# EAGLE schematic Datalogger (EAGLE 9.6.2)
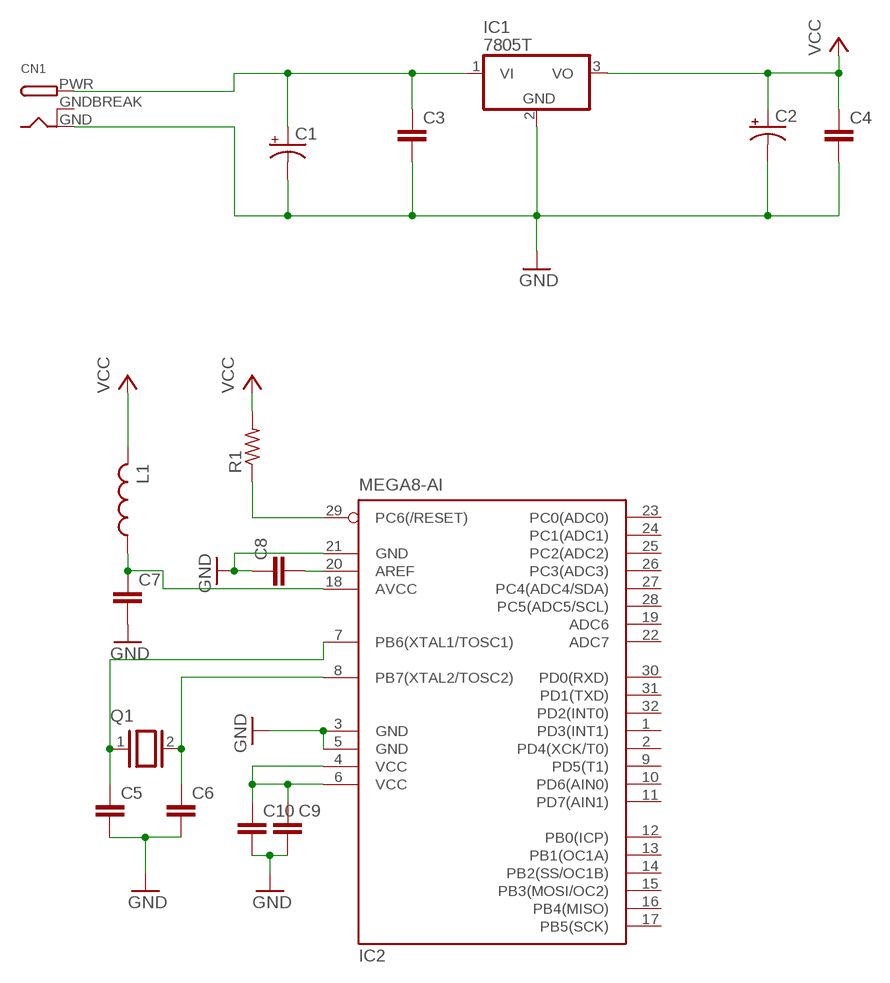
[diagram p0: schematic, sheet 1]

## Parts
C1  CPOL-US140CLH-1010  [140CLH-1010]
C2  CPOL-US140CLH-1010  [140CLH-1010]
C3  C-EUC0603  [C0603]
C4  C-EUC0603  [C0603]
C5  C-EUC0603  [C0603]
C6  C-EUC0603  [C0603]
C7  C-EUC0603  [C0603]
C8  C-EUC0603  [C0603]
C9  C-EUC0603  [C0603]
C10  C-EUC0603  [C0603]
CN1  DCBARRELPTH  [DCJACK_2MM_PTH]
IC1  7805T  [TO220H]
IC2  MEGA8-AI  [TQFP32-08]
L1  L-USL2012C  [L2012C]
Q1  XTAL/S  [QS]
R1  R-US_R0603  [R0603]

## Nets
GND: C1.- C2.- C3.2 C4.2 C5.2 C6.2 C7.2 C8.1 C9.2 C10.2 CN1.GND IC1.2(GND) IC2.3(GND) IC2.5(GND) IC2.21(GND)
N$1: C1.+ C3.1 CN1.PWR IC1.1(VI)
N$2: IC2.29(PC6(/RESET)) R1.1
N$3: C6.1 IC2.8(PB7(XTAL2/TOSC2)) Q1.2
N$4: C5.1 IC2.7(PB6(XTAL1/TOSC1)) Q1.1
N$5: C7.1 IC2.18(AVCC) L1.1
N$6: C9.1 C10.1 IC2.4(VCC) IC2.6(VCC)
N$7: C8.2 IC2.20(AREF)
VCC: C2.+ C4.1 IC1.3(VO) L1.2 R1.2
Unconnected: IC2.1(PD3(INT1)) IC2.2(PD4(XCK/T0)) IC2.9(PD5(T1)) IC2.10(PD6(AIN0)) IC2.11(PD7(AIN1)) IC2.12(PB0(ICP)) IC2.13(PB1(OC1A)) IC2.14(PB2(SS/OC1B)) IC2.15(PB3(MOSI/OC2)) IC2.16(PB4(MISO)) IC2.17(PB5(SCK)) IC2.19(ADC6) IC2.22(ADC7) IC2.23(PC0(ADC0)) IC2.24(PC1(ADC1)) IC2.25(PC2(ADC2)) IC2.26(PC3(ADC3)) IC2.27(PC4(ADC4/SDA)) IC2.28(PC5(ADC5/SCL)) IC2.30(PD0(RXD)) IC2.31(PD1(TXD)) IC2.32(PD2(INT0))

## Power pins joined to a net without a drawn wire
GNDBREAK: CN1.GNDBREAK

## Library data of the parts
C1 C2 = rcl:CPOL-US: POLARIZED CAPACITOR, American symbol; SPICEPREFIX: C
C3-C10 = rcl:C-EU: CAPACITOR, European symbol; SPICEPREFIX: C
CN1 = adafruit:DCBARREL: 2.0mm DC Barrel Jack DCJACK_2MM_PTH - Through Hole Jack (4UConnector: 05537)
IC1 = linear:78*: Positive VOLTAGE REGULATOR Source: http://cache.national.com/ds/LM/LM78L05.pdf http://www.fairchildsemi.com/ds/LM/LM7805.pdf
IC2 = atmel:MEGA8: MICROCONTROLLER 8 Kbytes FLASH, 1 kbytes SRAM, 512 bytes EEPROM, USART, 6-channel 10 bit ADC, 2-channel 8 bit ADC Pin compatible with Atmega48, ATMega88, ATMega168 Source: avr.lbr; MPN: ATMEGA8-16AU; OC_FARNELL: 9171371; OC_NEWARK: 73M8863
L1 = rcl:L-US: INDUCTOR, American symbol; SPICEPREFIX: L
Q1 = special:XTAL/S: CRYSTAL
R1 = rcl:R-US_: RESISTOR, American symbol; SPICEPREFIX: R